# Altium schematic sheet Encoder Fin ARM - Kinen Connector.SchDoc
size A
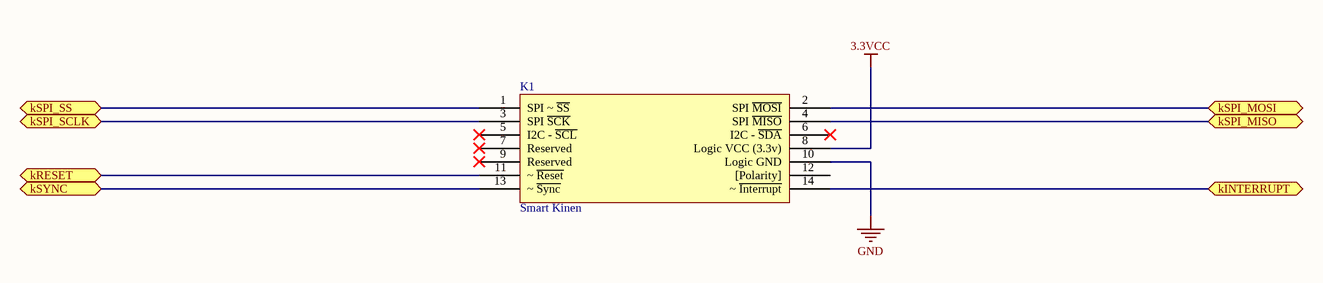
[diagram p0: Encoder Fin ARM - Kinen Connector.SchDoc]

## Parts
K1  Smart Kinen  [Kinen Fin - Smart Device]

## Ports
kINTERRUPT, kRESET, kSPI_MISO, kSPI_MOSI, kSPI_SCLK, kSPI_SS, kSYNC

## Nets
3.3VCC: K1.8(Logic_VCC_(3.3v))
GND: K1.10(Logic_GND)
kINTERRUPT: K1.14(~_~{Interrupt}) ; port kINTERRUPT
kRESET: K1.11(~_~{Reset}) ; port kRESET
kSPI_MISO: K1.4(SPI_~{MISO}) ; port kSPI_MISO
kSPI_MOSI: K1.2(SPI_~{MOSI}) ; port kSPI_MOSI
kSPI_SCLK: K1.3(SPI_~{SCK}) ; port kSPI_SCLK
kSPI_SS: K1.1(SPI_~_~{SS}) ; port kSPI_SS
kSYNC: K1.13(~_~{Sync}) ; port kSYNC

Not connected (* = marked no-connect by the designer): K1 5(I2C_-_~{SCL})* 6(I2C_-_~{SDA})* 7(Reserved)* 9(Reserved)* 12([Polarity])

## Library data of the parts
K1 = Kinen Device NEW Smart